# Altium project CAT24C32 Breakout.PrjPcb
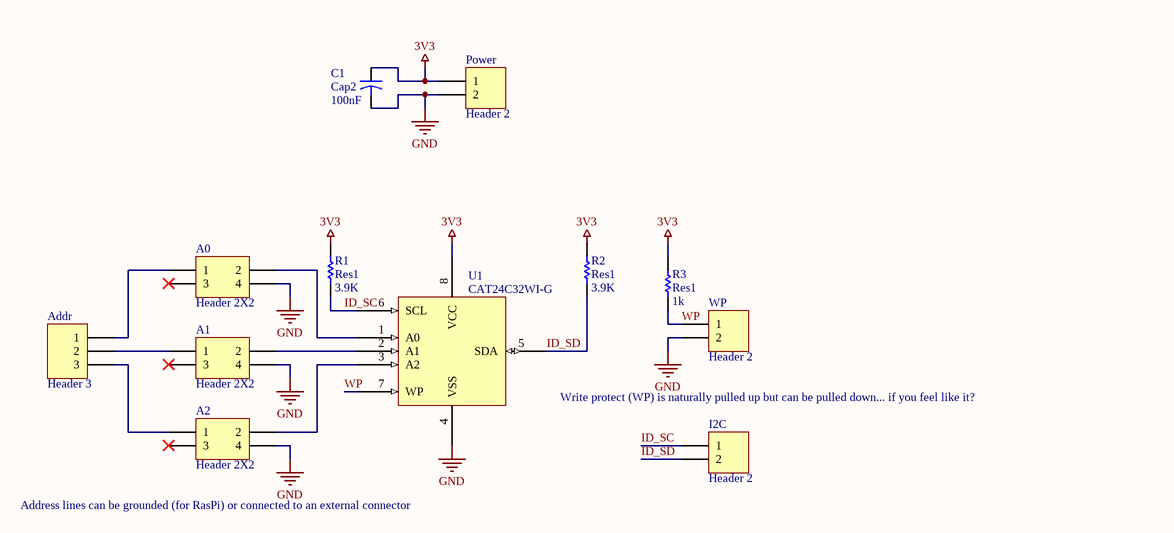
[diagram p0: CAT24C32 Breakout.SchDoc]
1 sheet, 12 parts. Net scope: global (net labels, ports and power ports of the same name join across sheets).
Board file: CAT24C32 Breakout.PcbDoc

## Sheet CAT24C32 Breakout.SchDoc
size A

### Parts
A0  Header 2X2  [HDR2X2]
A1  Header 2X2  [HDR2X2]
A2  Header 2X2  [HDR2X2]
Addr  Header 3  [HDR1X3]
C1  Cap2  value 100nF  [CAPR5-4X5]
I2C  Header 2  [HDR1X2]
Power  Header 2  [HDR1X2]
R1  Res1  value 3.9K  [AXIAL-0.3]
R2  Res1  value 3.9K  [AXIAL-0.3]
R3  Res1  value 1k  [AXIAL-0.3]
U1  CAT24C32WI-G  [CAT24C32WI-G]
WP  Header 2  [HDR1X2]

### Nets
3V3: C1.1 Power.1 R1.2 R2.2 R3.2 U1.8(VCC)
GND: A0.4 A1.4 A2.4 C1.2 Power.2 U1.4(VSS) WP.2
ID_SC: I2C.1 R1.1 U1.6(SCL)
ID_SD: I2C.2 R2.1 U1.5(SDA)
WP: R3.1 U1.7(WP) WP.1
NetA0_1: A0.1 Addr.1
NetA0_2: A0.2 U1.1(A0)
NetA1_1: A1.1 Addr.2
NetA1_2: A1.2 U1.2(A1)
NetA2_1: A2.1 Addr.3
NetA2_2: A2.2 U1.3(A2)

Not connected (* = marked no-connect by the designer): A0 3*; A1 3*; A2 3*

### Notes on the sheet
- Write protect (WP) is naturally pulled up but can be pulled down... if you feel like it?
- Address lines can be grounded (for RasPi) or connected to an external connector

### Library data of the parts
A0-A2 = Header 2X2: Header, 2-Pin, Dual row; LatestRevisionDate: 17-Jul-2002; LatestRevisionNote: Re-released for DXP Platform.; Publisher: Altium Limited
Addr = Header 3: Header, 3-Pin; LatestRevisionDate: 17-Jul-2002; LatestRevisionNote: Re-released for DXP Platform.; Publisher: Altium Limited
C1 = Cap2: Capacitor; Published: 23-Sep-2002; PackageReference: CAPR5-4X5; Publisher: Altium Limited; PackageDescription: Capacitor; 2 Leads
I2C Power WP = Header 2: Header, 2-Pin; LatestRevisionDate: 17-Jul-2002; LatestRevisionNote: Re-released for DXP Platform.; Publisher: Altium Limited
R1-R3 = Res1: Resistor; Published: 8-Jun-2000; LatestRevisionDate: 17-Jul-2002; LatestRevisionNote: Re-released for DXP Platform.; PackageReference: AXIAL-0.3; Publisher: Altium Limited; PackageDescription: Axial Device, Thru-Hole; 2 Leads; 0.3 in Pin Spacing
U1 = CAT24C32WI-G: IC EEPROM 32KBIT 400KHZ 8SOIC; Supplier 1: Digi-Key; Supplier Part Number 1: CAT24C32WI-GOS-ND